# Altium schematic sheet 08-USBOTG.SchDoc
size A4
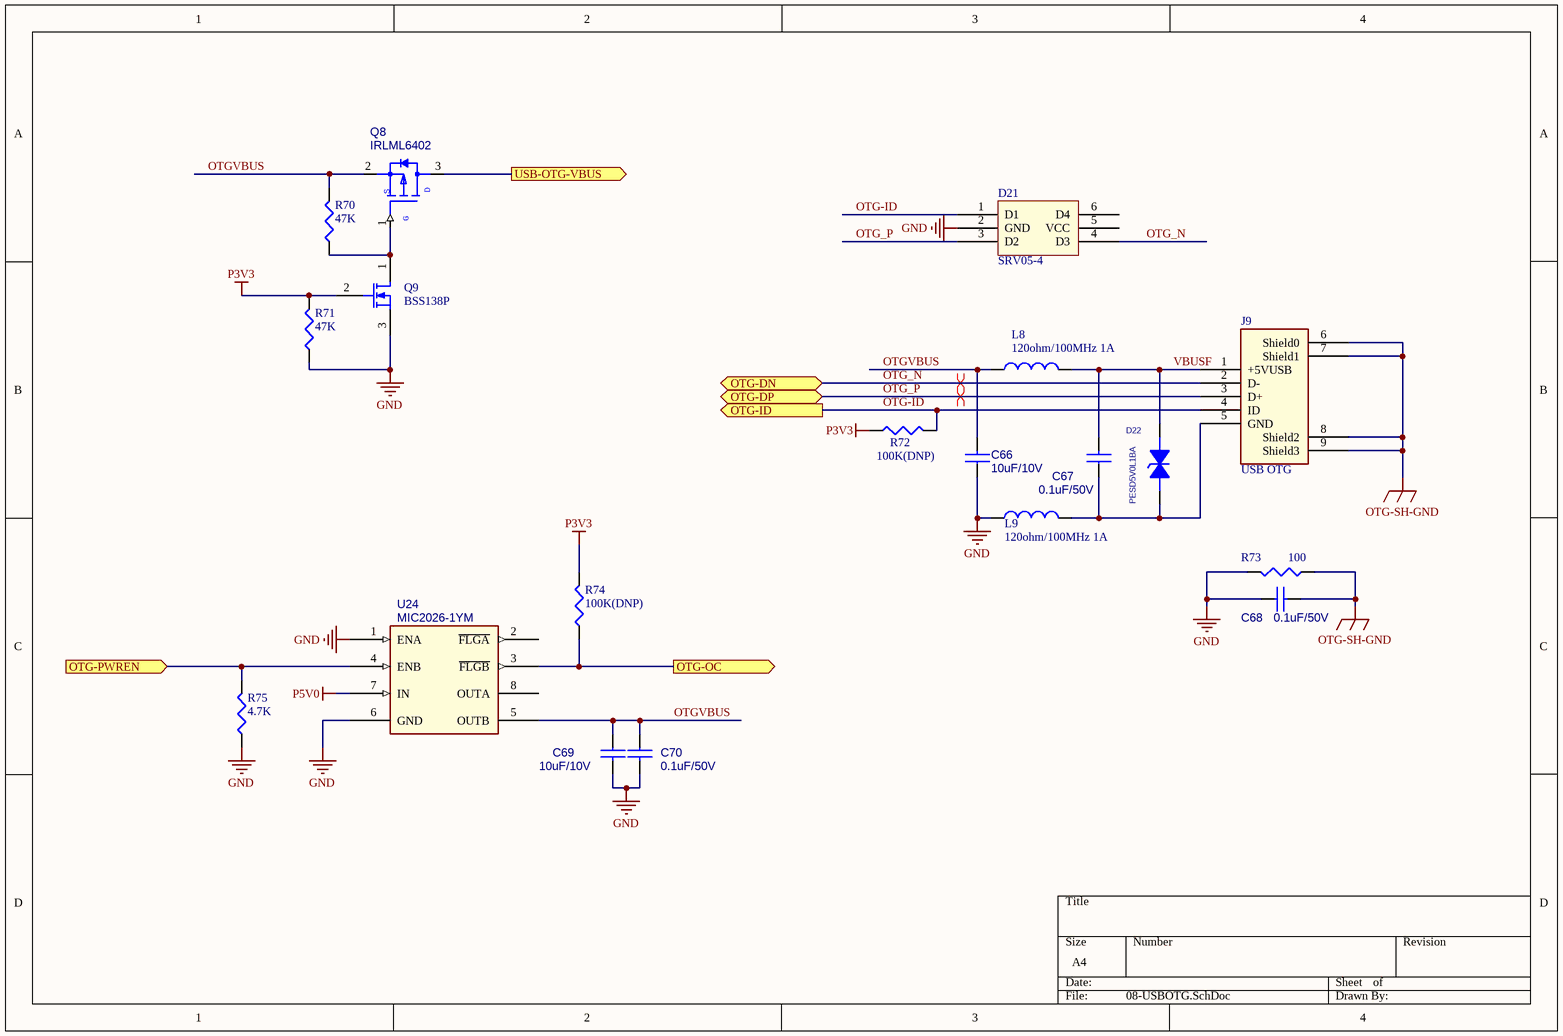
[diagram p0: 08-USBOTG.SchDoc]

## Parts
C66  10uF/10V  [0805]
C67  0.1uF/50V  [0402]
C68  0.1uF/50V  [0402]
C69  10uF/10V  [0805]
C70  0.1uF/50V  [0402]
D21  SRV05-4  [SOT23-6]
D22  PESD5V0L1BA  [SOD323]
J9  USB OTG  [MINIUSB-TYPEAB]
L8  120ohm/100MHz 1A  [0603]
L9  120ohm/100MHz 1A  [0603]
Q8  IRLML6402  [MOSFET]
Q9  BSS138P  [NPN]
R70  47K  [0402]
R71  47K  [0402]
R72  100K(DNP)  [0402]
R73  100  [0402]
R74  100K(DNP)  [0402]
R75  4.7K  [0402]
U24  MIC2026-1YM  [SO8]

## Ports
OTG-DN, OTG-DP (bidir), OTG-ID (out), OTG-OC (out), OTG-PWREN (in), USB-OTG-VBUS (out)

## Nets
GND: C66.1 C68.1 C69.2 C70.2 D21.2(GND) L9.1 Q9.3(S) R71.1 R73.2 R75.1 U24.1(ENA) U24.6(GND)
OTG-SH-GND: C68.2 J9.6(Shield0) J9.7(Shield1) J9.8(Shield2) J9.9(Shield3) R73.1
P3V3: Q9.2(G) R71.2 R72.1 R74.2
P5V0: U24.7(IN)
OTG-ID: D21.1(D1) J9.4(ID) R72.2 ; port OTG-ID
OTG-OC: R74.1 U24.3(~{FLGB}) ; port OTG-OC
OTG-PWREN: R75.2 U24.4(ENB) ; port OTG-PWREN
OTG_N: D21.4(D3) J9.2(D-) ; port OTG-DN
OTG_P: D21.3(D2) J9.3(D+) ; port OTG-DP
OTGVBUS: C66.2 C69.1 C70.1 L8.1 Q8.2(S) R70.2 U24.5(OUTB)
USB-OTG-VBUS: Q8.3(D) ; port USB-OTG-VBUS
VBUSF: C67.2 D22.2 J9.1(+5VUSB) L8.2
NetC67_1: C67.1 D22.1 J9.5(GND) L9.2
NetQ8_1: Q8.1(G) Q9.1(D) R70.1

Not connected (* = marked no-connect by the designer): D21 5(VCC) 6(D4); U24 2(~{FLGA}) 8(OUTA)

## Layout directives
differential pair: OTG_N, OTG_P

## Library data of the parts
C66-C70 = CAP_Dup1
D22 = PESD
J9 = FOX_UH51543-JS7: Part Number: SP063100800; NC: 10,11; ROOM: USB
L8 L9 = Inductor: Code_IEC: 1005; Value: 300ohm/100MHz BEAD; Published: 8-Jun-2000; LatestRevisionDate: 29-May-2009; LatestRevisionNote: IPC-7351 Footprint Added.; PackageReference: 0402-A; Publisher: Altium Limited; PackageDescription: Chip Inductor; Code_JEITA: 0402
Q8 = AO3401L_SOT23-3_0: Part Number: SB934010010; ROOM: USB POWER; Part Value: AO3401L_SOT23-3
Q9 = MOSFET-N: N-Channel MOSFET; Published: 8-Jun-2000; LatestRevisionDate: 17-Jul-2002; LatestRevisionNote: Re-released for DXP Platform.; PackageVersion: 1995/1996; PackageReference: E3; Publisher: Altium Limited; PackageDescription: TO, Flat Index; 3 In-Line, Axial Leads; Body Dia. 4.6mm; Lead Dia. 0.5 mm (max)
R70-R75 = CR16-1003FM
U24 = MIC2526_8P: IC LIN SW PWR ACTIVE HIGH DUAL 2.7V-5.5V 0.5A SOIC8; CAD_APPROVED: Yes; MFG_NAME01: MICREL; AGILE_PN: 312-75936; CLASS: IC; HEIGHT: 1.73mm; ROHS: Yes; MFG_PN01: MIC2026-1YM